# Altium schematic sheet 3V3_Monitor.SchDoc
size A
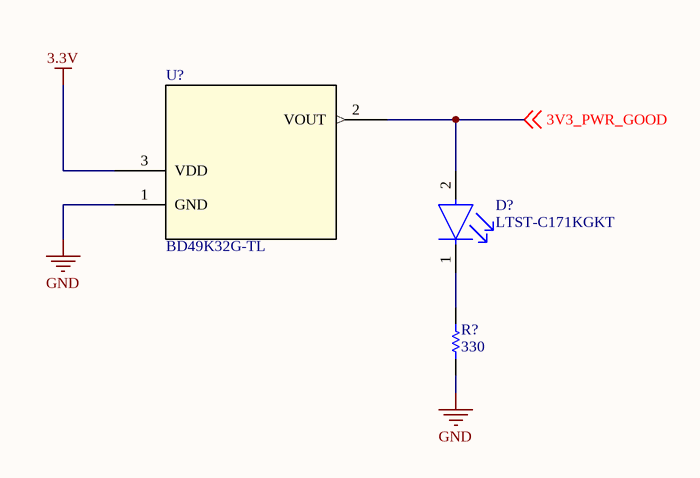
[diagram p0: 3V3_Monitor.SchDoc]

## Parts
D?  LTST-C171KGKT  [FP-LTST-C171KGKT-MFG]
R?  330  [RES_0805]
U?  BD49K32G-TL  [SSOP3_ROM]

## Nets
3.3V: U?.3(VDD)
GND: R?.1 U?.1(GND)
3V3_PWR_GOOD: D?.2(A) U?.2(VOUT) ; off-sheet 3V3_PWR_GOOD
NetD?_1: D?.1(C) R?.2

## Library data of the parts
D? = CMP-22017-000037-1: LED GREEN CLEAR SMD; Number of LEDs: 1; Viewing Angle: 130°; Lens Style: Rectangular; Dominant Wavelength: 571nm; Test Current: 20mA; Luminous Intensity: 35mcd; Power Rating: 75mW; Forward Voltage: 2.4V; Forward Current: 30mA; Reverse Voltage: 5V; Lens Color: Colorless; Wavelength: 574nm; Height: 0.8mm; Illumination Color: Green; Length: 2mm; Case/Package: 0805; Number of Pins: 2; Number of Elements: 1; Package Quantity: 1; Depth: 1.25mm; Lens Transparency: Clear; Width: 1.25mm; Color: Green; Radiation Hardening: No; Mount: Surface Mount; Packaging: Tape and Reel; Case Code (Metric): 2012; Lead Free: Lead Free; Max Operating Temperature: 85°C; Min Operating Temperature: -55°C; Case Code (Imperial): 0805; Power Dissipation: 75mW
R? = RES_0805_R_330.00: RES 330 OHM 1% 1/8W 0805; Manufacturer 1: Stackpole Electronics; Manufacturer Part Number 1: RMCF0805FT330R; Temperature Coefficient: 100ppm/°C; Resistance: 330R; Max Power Dissipation: 125mW; Features: Automotive AEC-Q200; Number of Terminations: 2; RoHS: Yes; Packaging: Tape and Reel; Tolerance: 1%; Category: Chip SMD Resistors; Supplier 1: Digi-Key; Supplier Part Number 1: RMCF0805FT330RCT-ND; Stock 1: 205996; Pricing 1: 1=0.10000, 10=0.02700, 100=0.01090, 1000=0.00488, 2500=0.00423 (USD); Mount: Surface Mount; Case/Package: 0805; Case Code (Metric): 2012; Case Code (Imperial): 0805; Contact Plating: Tin,Matte; Min Operating Temperature: -55°C; Max Operating Temperature: 155°C; Resistor Type: Thick Film; Series: RMCF; Construction: Rectangular; Length: 0.079inch; Width: 0.049inch; Height: 0.026inch; Depth: 1.25mm; Radiation Hardening: No; Military Standard: Not; Lead Free: Lead Free; RoHS Compliant: Yes; ComponentLink1URL: http://components.arrow.com/part/dataview/40963487S9848862N1174?src-supplier=Arrow+Electronics; ComponentLink1Description: http://components.arrow.com/part/dataview/40963487S9848862N1174?src-supplier=Arrow+Electronics; ComponentLink2URL: https://www.seielect.com/catalog/SEI-RMCF_RMCP.pdf?src-supplier=Avnet; ComponentLink2Description: https://www.seielect.com/catalog/SEI-RMCF_RMCP.pdf?src-supplier=Avnet; ComponentLink3URL: https://www.seielect.com/Catalog/SEI-RMCF_RMCP.pdf?src-supplier=Digi-Key; ComponentLink3Description: https://www.seielect.com/Catalog/SEI-RMCF_RMCP.pdf?src-supplier=Digi-Key; ComponentLink4URL: https://www.seielect.com/catalog/SEI-Packaging.pdf?src-supplier=Digi-Key; ComponentLink4Description: https://www.seielect.com/catalog/SEI-Packaging.pdf?src-supplier=Digi-Key; ComponentLink5URL: https://www.verical.com/server-webapp/html/getDatasheet?partID=559884&src-supplier=Verical; ComponentLink5Description: https://www.verical.com/server-webapp/html/getDatasheet?partID=559884&src-supplier=Verical
U? = BD49K32G-TL: No Description Available; Mfr_Name: ROHM Semiconductor; Copyright: Copyright (C) 2022 Ultra Librarian. All rights reserved.; Manufacturer_Part_Number: BD49K32G-TL; Digi-Key_Part_Number_1: BD49K32G-TLTR-ND; Digi-Key_Part_Number_2: BD49K32G-TLCT-ND; Digi-Key_Part_Number_3: BD49K32G-TLDKR-ND; RefDes: RefDes; Type: DEV